# EasyEDA Pro project ProDoc_Schematic1_2025-12-06 (1).epro

# Schematic Schematic1
Board Name: Board1; Create Date: 2025-12-06; Page Name: P1; Project Name: Andy LED Chaser; Schematic Name: Schematic1; Update Date: 2025-12-06; Company: EasyEDA.com; Page Size: A4; Version: V1.0
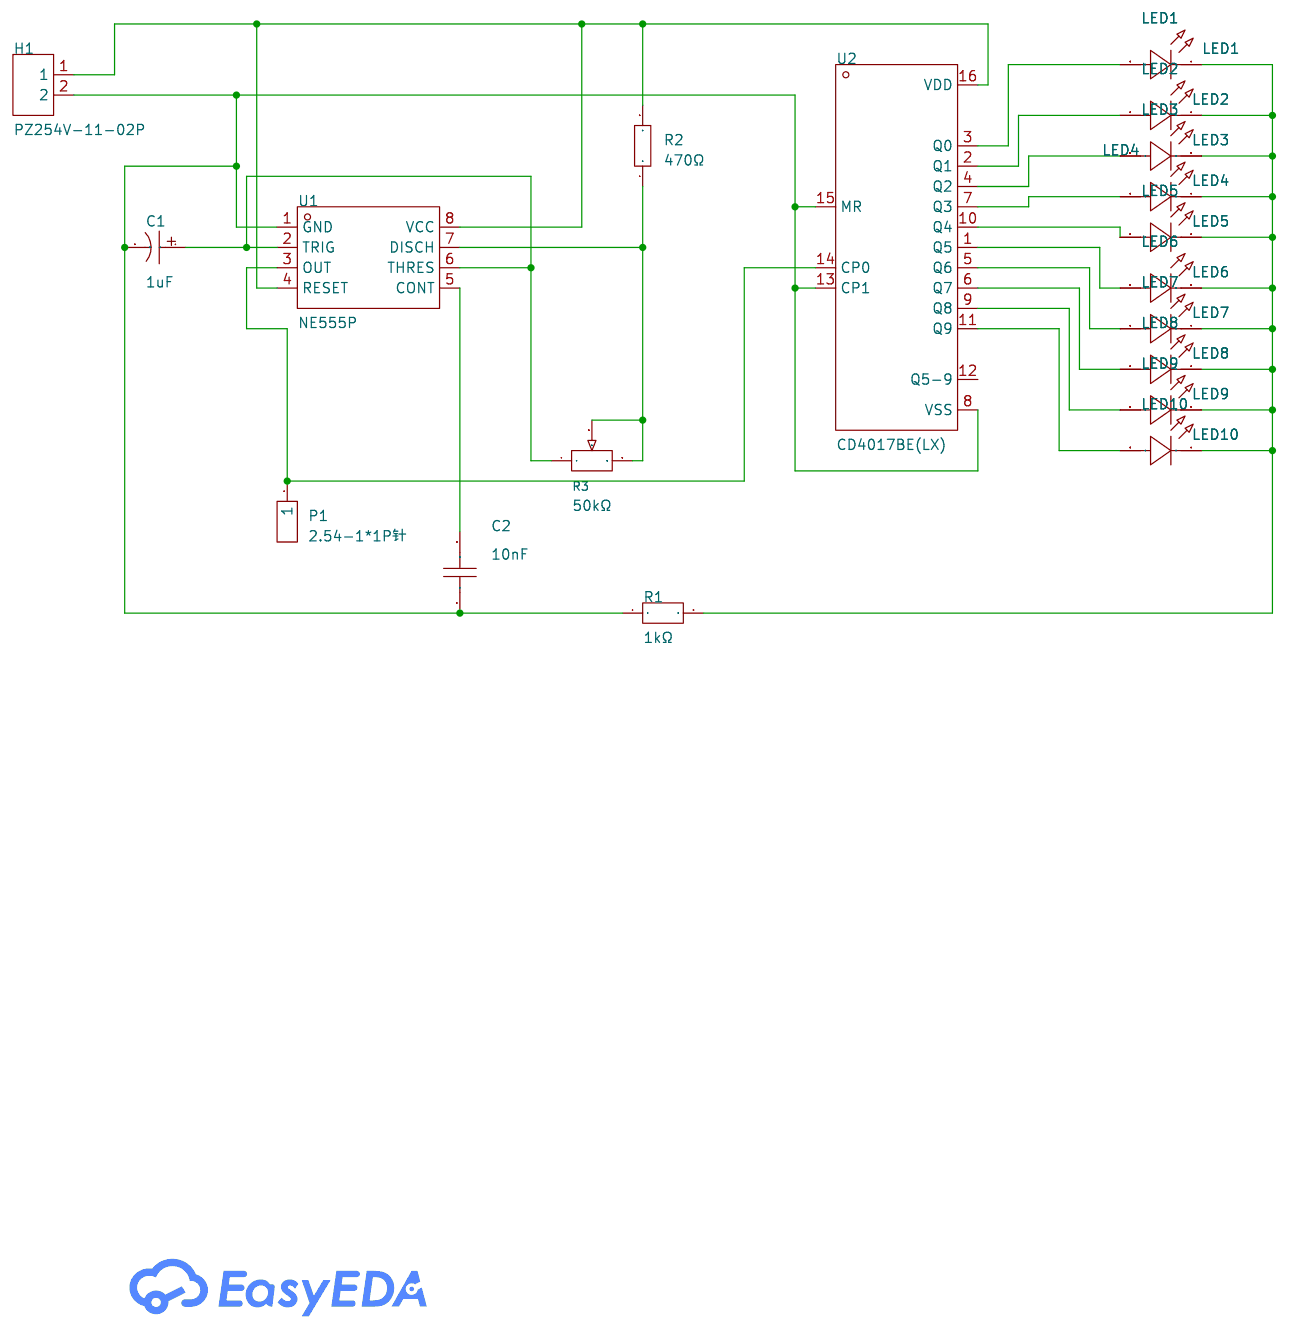
[diagram p0: schematic sheet]

## Parts
C1  1uF  [CAP-TH_BD5.0-P2.00-D0.8-FD]
C2  10nF  [CAP-TH_L8.0-W4.0-P5.00-D1.2]
H1  PZ254V-11-02P  [HDR-TH_2P-P2.54-V-M]
LED1  LED1  [LED-TH_BD5.9-P2.54-RD_WHITE]
LED2  LED2  [LED-TH_BD5.9-P2.54-RD_WHITE]
LED3  LED3  [LED-TH_BD5.9-P2.54-RD_WHITE]
LED4  LED4  [LED-TH_BD5.9-P2.54-RD_WHITE]
LED5  LED5  [LED-TH_BD5.9-P2.54-RD_WHITE]
LED6  LED6  [LED-TH_BD5.9-P2.54-RD_WHITE]
LED7  LED7  [LED-TH_BD5.9-P2.54-RD_WHITE]
LED8  LED8  [LED-TH_BD5.9-P2.54-RD_WHITE]
LED9  LED9  [LED-TH_BD5.9-P2.54-RD_WHITE]
LED10  LED10  [LED-TH_BD5.9-P2.54-RD_WHITE]
P1  2.54-1*1P针  [HDR-TH_1P-P2.54-V-M]
R1  1kΩ  [RES-TH_BD2.3-L6.5-P10.50-D0.5]
R2  470Ω  [RES-TH_BD2.2-L6.5-P10.50-D0.6]
R3  50kΩ  [RES-ADJ-TH_3P-L9.5-W4.85-P2.50-BL-L]
U1  NE555P  [DIP-8_L9.8-W6.6-P2.54-LS7.6-BL]
U2  CD4017BE(LX)  [PDIP-16_L19.3-W6.4-P2.54-LS7.94-BL]

## Library data of the parts
C1 = KF010M050C110A: Capacitance:1uF Tolerance:±20% Tolerance:±20% Voltage Rating:50V Pin Spacing:2mm Diameter:5mm Height - Seated (Max):11mm Lifetime:2000hrs@105℃; LCSC Part Name: 1uF ±20% 50V; Supplier Part: C62934; Manufacturer: CapXon(丰宾); Supplier Footprint: 插件,D5xL11mm; JLCPCB Part Class: Extended Part; Datasheet: https://item.szlcsc.com/datasheet/KF010M050C110A/63997.html; Supplier: LCSC; Tolerance: ±20%; Voltage Rating: 50V; Pin Spacing: 2mm; Diameter: 5mm; Height - Seated (Max): 11mm; Lifetime: 2000hrs@105℃
C2 = N09F1B103MN0B0S0N0: Capacitance:10nF Tolerance:±20% Tolerance:±20% Voltage Rating:1kV Pin Spacing:5mm Temperature Coefficient:Y5V Diameter:8.5mm Body Thickness:2.5mm; LCSC Part Name: 10nF ±20% 1kV; Supplier Part: C249157; Manufacturer: STE(松田); Supplier Footprint: 插件,P=5mm; JLCPCB Part Class: Extended Part; Datasheet: https://item.szlcsc.com/datasheet/N09F1B103MN0B0S0N0/245516.html; Supplier: LCSC; Tolerance: ±20%; Voltage Rating: 1kV; Pin Spacing: 5mm; Temperature Coefficient: Y5V; Diameter: 8.5mm; Body Thickness: 2.5mm
H1 = PZ254V-11-02P: Pin Structure:1x2P Pitch:2.54mm Row Spacing:- Circluar Pins/Square Pins:Pin Header Mounting Type:Through Hole Number of Rows:1 Number of Pins:2P Current Rating:- Voltage Rating (Max):- Length of Mating Pin:6mm Insulation Height:2.5mm Length of End Connect; LCSC Part Name: 1x2P 间距:2.54mm 方针 直插; Supplier Part: C492401; Manufacturer: XFCN(兴飞); Supplier Footprint: 插件,P=2.54mm; JLCPCB Part Class: Extended Part; Datasheet: https://item.szlcsc.com/datasheet/PZ254V-11-02P/502957.html; Supplier: LCSC; Pin Structure: 1x2P; Pitch: 2.54mm; Circluar Pins/Square Pins: Pin Header; Mounting Type: Through Hole; Number of Rows: 1; Number of Pins: 2P; Length of Mating Pin: 6mm; Insulation Height: 2.5mm; Length of End Connection Pin: 3mm; Contact Material: Brass; Operating Temperature: -40℃~+105℃; Color: Black
LED1-LED10 = XL-502UWC: Lamp Holder Type:5mm Round Lens Illumination Color:White Voltage - Forward(Vf):3.3V Voltage - Forward(Vf):3.3V Power(Watts):70mW Forward Current:20mA Lens Color:Water Clear Color Temperature:9000K~20000K Color Temperature:9000K~20000K Luminous Intensity:2; LCSC Part Name: F5白发白短脚; Supplier Part: C2895480; Manufacturer: XINGLIGHT(成兴光); Supplier Footprint: 插件,D=5mm; JLCPCB Part Class: Extended Part; Datasheet: https://item.szlcsc.com/datasheet/XL-502UWC/3136195.html; Supplier: LCSC; Lamp Holder Type: 5mm Round Lens; Illumination Color: White; Voltage - Forward(Vf): 3.3V; Power(Watts): 70mW; Forward Current: 20mA; Lens Color: Water Clear; Color Temperature: 9000K~20000K; Luminous Intensity: 20000mcd; Viewing Angle: 30°; Operating Temperature: -25℃~+85℃
P1 = 2.54-1*1P针: Pin Structure:- Pitch:- Row Spacing:- Circluar Pins/Square Pins:Pin Header Mounting Type:Through Hole Number of Rows:1 Number of Pins:1P Current Rating:3A Voltage Rating (Max):- Length of Mating Pin:6mm Insulation Height:2.5mm Length of End Connection Pin; LCSC Part Name: 方针 直插; Supplier Part: C81276; Manufacturer: BOOMELE(博穆精密); Supplier Footprint: 插件,P=2.54mm; JLCPCB Part Class: Extended Part; Datasheet: https://item.szlcsc.com/datasheet/2.54-1*1P%25E9%2592%2588/82426.html; Supplier: LCSC; Circluar Pins/Square Pins: Pin Header; Mounting Type: Through Hole; Number of Rows: 1; Number of Pins: 1P; Current Rating: 3A; Length of Mating Pin: 6mm; Insulation Height: 2.5mm; Length of End Connection Pin: 3mm; Contact Material: Brass; Contact Plating: Gold; Operating Temperature: -55℃~+105℃; Color: Black
R1 = MF1/4W-1KΩ±1%T52: Type:Metal Film Resistors Resistance: Tolerance:±1% Tolerance:±1% Power(Watts):250mW Temperature Coefficient:±200ppm/℃ Temperature Coefficient:±200ppm/℃; LCSC Part Name: 金属膜电阻 1kΩ ±1% 250mW; Supplier Part: C713997; Manufacturer: 华星机电; Supplier Footprint: 插件,D2.3xL6.5mm; JLCPCB Part Class: Extended Part; Datasheet: https://atta.szlcsc.com/upload/public/pdf/source/20200731/C713882_AE8EB1102749D7E4FB4FB13DC898C429.pdf; Supplier: LCSC; Type: Metal Film Resistors; Tolerance: ±1%; Power(Watts): 250mW; Temperature Coefficient: ±200ppm/℃
R2 = MFR0W4F4700A50: Type:Metal Film Resistors Resistance: Tolerance:±1% Tolerance:±1% Voltage-Supply(Max):250V Power(Watts):250mW Temperature Coefficient:±50ppm/℃ Temperature Coefficient:±50ppm/℃; LCSC Part Name: 470Ω ±1% 250mW 金属膜电阻 铜脚，圆柱状直插; Supplier Part: C58592; Manufacturer: UNI-ROYAL(厚声); Supplier Footprint: 插件,D2.2xL6.5mm; JLCPCB Part Class: Extended Part; Datasheet: https://atta.szlcsc.com/upload/public/pdf/source/20191012/C436293_8820AA14BC71FA35E551C06C441482A0.pdf; Supplier: LCSC; Type: Metal Film Resistors; Tolerance: ±1%; Voltage-Supply(Max): 250V; Power(Watts): 250mW; Temperature Coefficient: ±50ppm/℃
R3 = 3296X-1-503_C118912: Resistance:50kΩ Tolerance:±10% Tolerance:±10% Power(Watts):500mW Temperature Coefficient:±250ppm/℃ Temperature Coefficient:±250ppm/℃ Number of Turns:30; LCSC Part Name: 50kΩ ±10%; Supplier Part: C118912; Manufacturer: BOCHEN(博晨); Manufacturer Part: 3296X-1-503; Supplier Footprint: 插件-3P,9.5x4.9mm; JLCPCB Part Class: Extended Part; Datasheet: https://item.szlcsc.com/datasheet/3296X-1-503/120181.html; Supplier: LCSC; Tolerance: ±10%; Power(Watts): 500mW; Temperature Coefficient: ±250ppm/℃; Number of Turns: 30
U1 = NE555P: Supplier Part: C46749; Manufacturer: TI(德州仪器); Supplier Footprint: DIP-8; JLCPCB Part Class: Extended Part; Datasheet: https://www.ti.com/cn/lit/gpn/ne555; Supplier: LCSC
U2 = CD4017BE(LX): Logic Type:Divide-by-10 Direction:Up Counter Voltage - Supply:3V~15V Voltage - Supply:3V~15V Number of Elements:1 Trigger Type:Rising Edge Reset:Asynchronous Count Rate:11MHz Operating Temperature:-40℃~+85℃ Operating Temperature:-40℃~+85℃; Supplier Part: C32710674; Manufacturer: LX(灵星芯微); Supplier Footprint: DIP-16; JLCPCB Part Class: Extended Part; Datasheet: https://atta.szlcsc.com/upload/public/pdf/source/20240723/A05E41C3796D239DF5E274CF6ACDBDA1.pdf; Supplier: LCSC; Logic Type: Divide-by-10; Direction: Up Counter; Voltage - Supply: 3V~15V; Number of Elements: 1; Trigger Type: Rising Edge; Reset: Asynchronous; Count Rate: 11MHz; Operating Temperature: -40℃~+85℃

## Nets
Net-(C1-1): C1.1 R3.1 U1.2(TRIG) U1.6(THRES)
Net-(C1-2): C1.2 C2.1 H1.2 R1.1 U1.1(GND) U2.8(VSS) U2.13(CP1) U2.15(MR)
Net-(C2-2): C2.2 U1.5(CONT)
Net-(H1-1): H1.1 R2.2 U1.4(RESET) U1.8(VCC) U2.16(VDD)
Net-(LED1-1): LED1.1(K) LED2.1(K) LED3.1(K) LED4.1(K) LED5.1(K) LED6.1(K) LED7.1(K) LED8.1(K) LED9.1(K) LED10.1(K) R1.2
Net-(LED1-2): LED1.2(A) U2.3(Q0)
Net-(LED2-2): LED2.2(A) U2.2(Q1)
Net-(LED3-2): LED3.2(A) U2.4(Q2)
Net-(LED4-2): LED4.2(A) U2.7(Q3)
Net-(LED5-2): LED5.2(A) U2.10(Q4)
Net-(LED6-2): LED6.2(A) U2.1(Q5)
Net-(LED7-2): LED7.2(A) U2.5(Q6)
Net-(LED8-2): LED8.2(A) U2.6(Q7)
Net-(LED9-2): LED9.2(A) U2.9(Q8)
Net-(LED10-2): LED10.2(A) U2.11(Q9)
Net-(P1-1): P1.1 U1.3(OUT) U2.14(CP0)
Net-(R2-1): R2.1 R3.2 R3.3 U1.7(DISCH)

Not connected (* = marked no-connect by the designer): U2 12(Q5-9)
